# EAGLE schematic Ex Controller 1 USB Device (EAGLE 7.6.0)
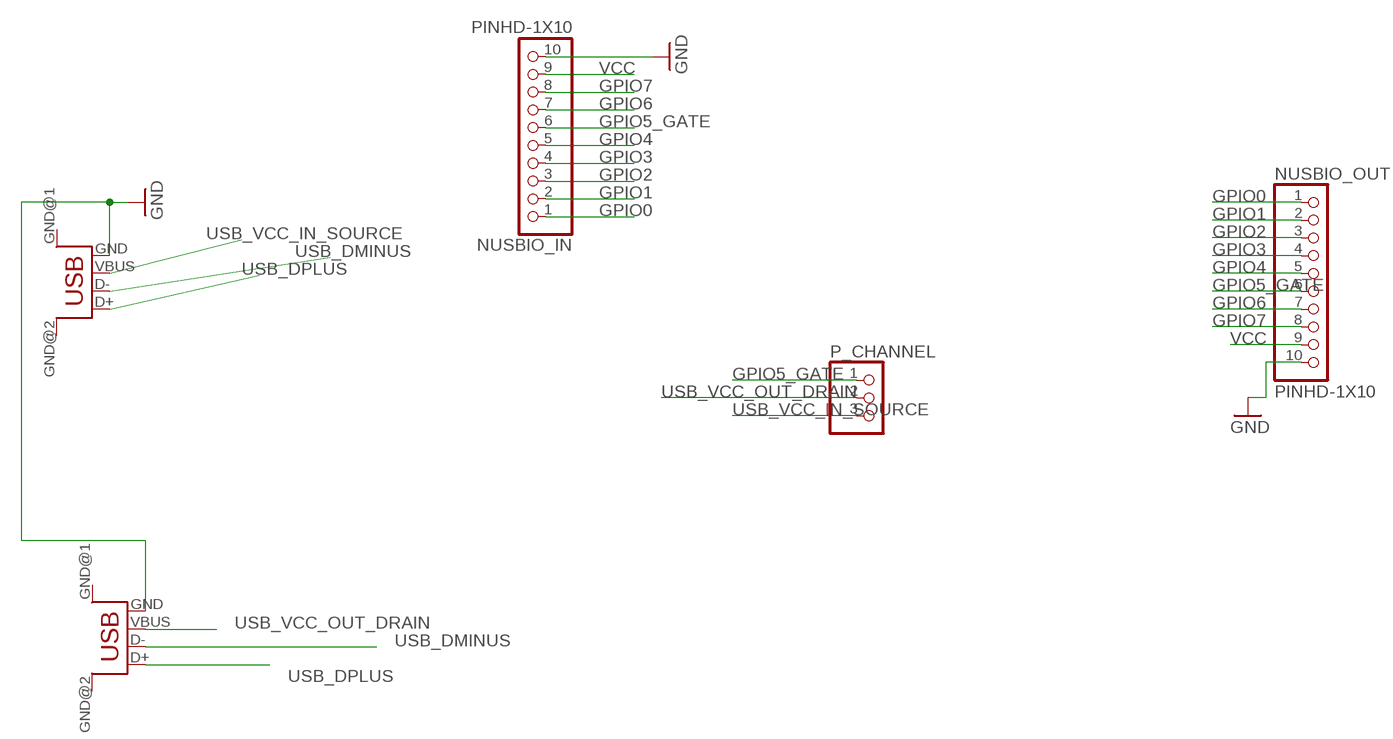
[diagram p0: schematic, sheet 1]

## Parts
NUSBIO_IN  PINHD-1X10  [1X10-BIG]
NUSBIO_OUT  PINHD-1X10  [1X10-BIG]
P_CHANNEL  PINHD-1X3  [1X03]
USB_DEV_INPUT  USB  [USB-FEMALE-A-PTH]
USB_DEV_OUTPUT  USB  [USB-FEMALE-A-PTH]

## Nets
GND: NUSBIO_IN.10 NUSBIO_OUT.10 USB_DEV_INPUT.GND USB_DEV_OUTPUT.GND
GPIO0: NUSBIO_IN.1 NUSBIO_OUT.1
GPIO1: NUSBIO_IN.2 NUSBIO_OUT.2
GPIO2: NUSBIO_IN.3 NUSBIO_OUT.3
GPIO3: NUSBIO_IN.4 NUSBIO_OUT.4
GPIO4: NUSBIO_IN.5 NUSBIO_OUT.5
GPIO5_GATE: NUSBIO_IN.6 NUSBIO_OUT.6 P_CHANNEL.1
GPIO6: NUSBIO_IN.7 NUSBIO_OUT.7
GPIO7: NUSBIO_IN.8 NUSBIO_OUT.8
USB_DMINUS: USB_DEV_INPUT.D- USB_DEV_OUTPUT.D-
USB_DPLUS: USB_DEV_INPUT.D+ USB_DEV_OUTPUT.D+
USB_VCC_IN_SOURCE: P_CHANNEL.3 USB_DEV_INPUT.VBUS
USB_VCC_OUT_DRAIN: P_CHANNEL.2 USB_DEV_OUTPUT.VBUS
VCC: NUSBIO_IN.9 NUSBIO_OUT.9
Unconnected: USB_DEV_INPUT.GND@1(GND) USB_DEV_INPUT.GND@2(GND) USB_DEV_OUTPUT.GND@1(GND) USB_DEV_OUTPUT.GND@2(GND)

## Library data of the parts
NUSBIO_IN NUSBIO_OUT = adafruit:PINHD-1X10: Pin header 1x10 0.1" spacing With round pins
P_CHANNEL = adafruit:PINHD-1X3: PIN HEADER
USB_DEV_INPUT USB_DEV_OUTPUT = STUNTAZ:USB: USB Connectors USB-FEMALE-A-PTH: Through hole Female Type A Connector